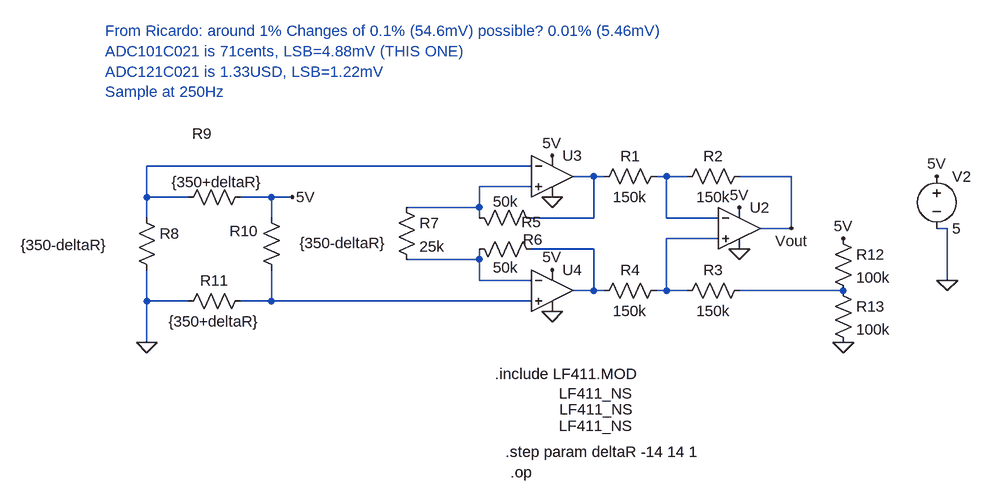
[diagram p0: schematic StrainGauge.asc]
StrainGauge.asc, the LTspice schematic file:
Version 4.1
SHEET 1 880 680
WIRE 96 144 -496 144
WIRE 192 160 160 160
WIRE 208 160 192 160
WIRE 304 160 288 160
WIRE 336 160 304 160
WIRE 496 160 416 160
WIRE 96 176 16 176
WIRE -496 192 -496 144
WIRE -432 192 -496 192
WIRE -304 192 -352 192
WIRE -272 192 -304 192
WIRE 16 208 16 176
WIRE 16 208 -96 208
WIRE -496 224 -496 192
WIRE -304 224 -304 192
WIRE 16 224 16 208
WIRE 192 224 192 160
WIRE 192 224 96 224
WIRE 304 224 304 160
WIRE 384 224 304 224
WIRE 496 240 496 160
WIRE 496 240 448 240
WIRE 736 240 720 240
WIRE 384 256 304 256
WIRE 192 272 96 272
WIRE 16 288 16 272
WIRE 16 288 -96 288
WIRE 16 320 16 288
WIRE 96 320 16 320
WIRE 736 320 736 240
WIRE 192 336 192 272
WIRE 192 336 160 336
WIRE 208 336 192 336
WIRE 304 336 304 256
WIRE 304 336 288 336
WIRE 336 336 304 336
WIRE 576 336 416 336
WIRE -496 352 -496 304
WIRE -432 352 -496 352
WIRE -304 352 -304 304
WIRE -304 352 -352 352
WIRE 96 352 -304 352
WIRE -496 416 -496 352
FLAG 736 320 0
FLAG 720 160 5V
FLAG 416 208 5V
FLAG 416 272 0
FLAG 128 368 0
FLAG 128 192 0
FLAG 128 304 5V
FLAG 128 128 5V
FLAG 496 240 Vout
FLAG -496 416 0
FLAG 576 416 0
FLAG 576 256 5V
FLAG -272 192 5V
SYMBOL OpAmps\\opamp2 128 272 R0
WINDOW 3 11 247 Left 2
SYMATTR InstName U4
SYMATTR Value LF411_NS
SYMBOL res 304 144 R90
WINDOW 0 0 56 VBottom 2
WINDOW 3 32 56 VTop 2
SYMATTR InstName R1
SYMATTR Value 150k
SYMBOL res 432 144 R90
WINDOW 0 0 56 VBottom 2
WINDOW 3 32 56 VTop 2
SYMATTR InstName R2
SYMATTR Value 150k
SYMBOL res 432 320 R90
WINDOW 0 0 56 VBottom 2
WINDOW 3 32 56 VTop 2
SYMATTR InstName R3
SYMATTR Value 150k
SYMBOL res 304 320 R90
WINDOW 0 0 56 VBottom 2
WINDOW 3 32 56 VTop 2
SYMATTR InstName R4
SYMATTR Value 150k
SYMBOL OpAmps\\opamp2 416 176 R0
WINDOW 3 -278 368 Left 2
SYMATTR InstName U2
SYMATTR Value LF411_NS
SYMBOL OpAmps\\opamp2 128 96 R0
WINDOW 3 10 398 Left 2
SYMATTR InstName U3
SYMATTR Value LF411_NS
SYMBOL voltage 720 144 R0
WINDOW 123 0 0 Left 0
WINDOW 39 0 0 Left 0
SYMATTR InstName V2
SYMATTR Value 5
SYMBOL res 0 256 M90
WINDOW 0 -10 96 VBottom 2
WINDOW 3 29 56 VTop 2
SYMATTR InstName R5
SYMATTR Value 50k
SYMBOL res 0 208 M90
WINDOW 0 65 98 VBottom 2
WINDOW 3 -25 56 VTop 2
SYMATTR InstName R6
SYMATTR Value 50k
SYMBOL res -112 192 R0
SYMATTR InstName R7
SYMATTR Value 25k
SYMBOL res -512 208 R0
WINDOW 3 -178 58 Left 2
SYMATTR InstName R8
SYMATTR Value {350-deltaR}
SYMBOL res -336 176 R90
WINDOW 0 -66 75 VBottom 2
WINDOW 3 -23 51 VTop 2
SYMATTR InstName R9
SYMATTR Value {350+deltaR}
SYMBOL res -288 320 R180
WINDOW 0 36 76 Left 2
WINDOW 3 -162 57 Left 2
SYMATTR InstName R10
SYMATTR Value {350-deltaR}
SYMBOL res -448 368 R270
WINDOW 0 32 56 VTop 2
WINDOW 3 0 56 VBottom 2
SYMATTR InstName R11
SYMATTR Value {350+deltaR}
SYMBOL res 560 240 R0
SYMATTR InstName R12
SYMATTR Value 100k
SYMBOL res 560 320 R0
SYMATTR InstName R13
SYMATTR Value 100k
TEXT 40 464 Left 2 !.include LF411.MOD
TEXT 56 584 Left 2 !.step param deltaR -14 14 1
TEXT 64 616 Left 2 !.op
TEXT -560 -64 Left 2 ;From Ricardo: around 1% Changes of 0.1% (54.6mV) possible? 0.01% (5.46mV)\nADC101C021 is 71cents, LSB=4.88mV (THIS ONE)\nADC121C021 is 1.33USD, LSB=1.22mV\nSample at 250Hz

The netlist it stands for:
* StrainGauge.asc
X§U4 N009 N007 5V 0 N006 LF411_NS  ; pins In+ In- V+ V- OUT
R1 N003 N002 150k
R2 Vout N003 150k
R3 N008 N005 150k
R4 N005 N006 150k
X§U2 N005 N003 5V 0 Vout LF411_NS  ; pins In+ In- V+ V- OUT
X§U3 N004 N001 5V 0 N002 LF411_NS  ; pins In+ In- V+ V- OUT
V2 5V 0 5
R5 N007 N006 50k
R6 N004 N002 50k
R7 N004 N007 25k
R8 N001 0 {350-deltaR}
R9 5V N001 {350+deltaR}
R10 N009 5V {350-deltaR}
R11 0 N009 {350+deltaR}
R12 5V N008 100k
R13 N008 0 100k
.include LF411.MOD
.step param deltaR -14 14 1
.op
* From Ricardo: around 1% Changes of 0.1% (54.6mV) possible? 0.01% (5.46mV)
* ADC101C021 is 71cents, LSB=4.88mV (THIS ONE)
* ADC121C021 is 1.33USD, LSB=1.22mV
* Sample at 250Hz
.backanno
.end